# Altium schematic sheet Touch.SchDoc
size 209 x 148 mm
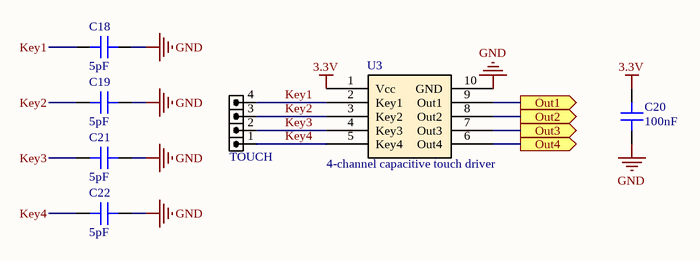
[diagram p0: Touch.SchDoc]

## Parts
C18  5pF  [CAP 0603_1608]
C19  5pF  [CAP 0603_1608]
C20  100nF  [CAP 0603_1608]
C21  5pF  [CAP 0603_1608]
C22  5pF  [CAP 0603_1608]
TOUCH  HDR4  [HDR1SE_M_1X4]  (value not drawn)
U3  4-channel capacitive touch driver  [MSOP-10]

## Ports
Out1 (out), Out2 (out), Out3 (out), Out4 (out)

## Nets
3.3V: C20.2 U3.1(Vcc)
GND: C18.2 C19.2 C20.1 C21.2 C22.2 U3.10(GND)
Key1: C18.1 TOUCH.4 U3.2(Key1)
Key2: C19.1 TOUCH.3 U3.3(Key2)
Key3: C21.1 TOUCH.2 U3.4(Key3)
Key4: C22.1 TOUCH.1 U3.5(Key4)
Out1: U3.9(Out1) ; port Out1
Out2: U3.8(Out2) ; port Out2
Out3: U3.7(Out3) ; port Out3
Out4: U3.6(Out4) ; port Out4

## Library data of the parts
C18-C22 = Cap 0603: SMT Capacitor
  C18 C19 C21 C22: VALUE: 5pF
  C20: VALUE: 100nF
TOUCH = HDRTST_1X4: HEADER, 1mm pitch, test, SMD; VALUE: HDR4
U3 = BS814A-1